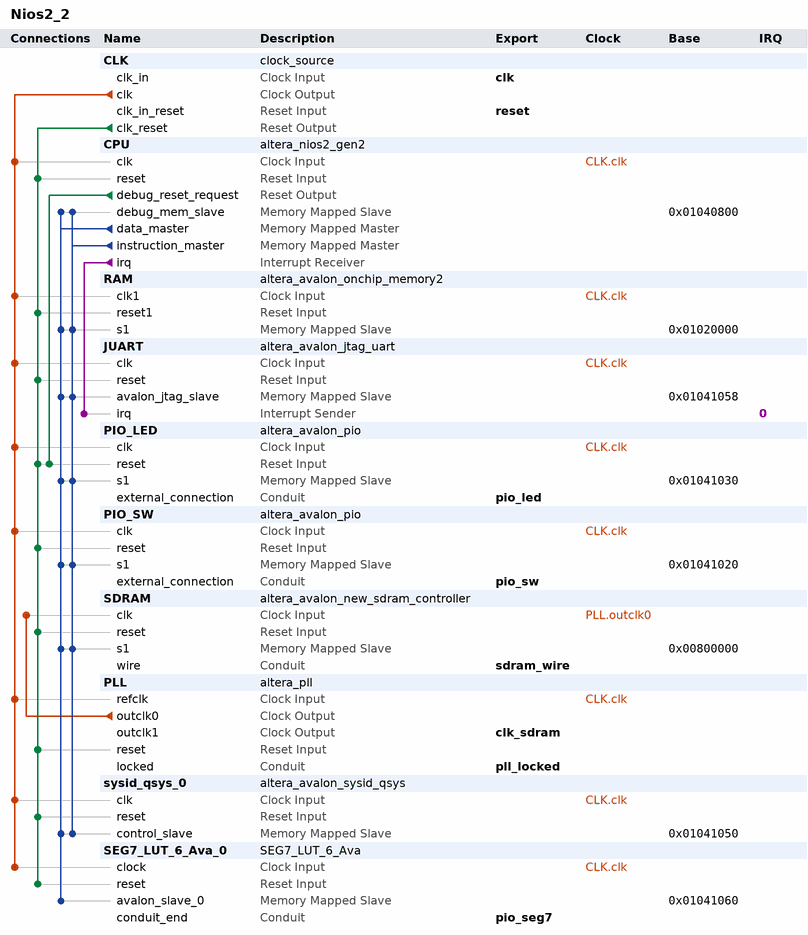
[diagram p0: system contents]
# Platform Designer (Qsys) system Nios2_2, Cyclone V 5CSXFC6D6F31C6
# Parameters at their usual value, and those the tool derives, are not listed.
package require -exact qsys 18.1
create_system Nios2_2
set_project_property DEVICE_FAMILY {Cyclone V}
set_project_property DEVICE 5CSXFC6D6F31C6

add_instance CLK clock_source 18.1
set_instance_parameter_value CLK clockFrequency 50000000

add_instance CPU altera_nios2_gen2 18.1
set_instance_parameter_value CPU dcache_size 2048
set_instance_parameter_value CPU exceptionSlave SDRAM.s1
set_instance_parameter_value CPU icache_size 4096
set_instance_parameter_value CPU impl Tiny
set_instance_parameter_value CPU resetSlave SDRAM.s1
set_instance_parameter_value CPU setting_activateTrace true

add_instance RAM altera_avalon_onchip_memory2 18.1
set_instance_parameter_value RAM dataWidth 32
set_instance_parameter_value RAM dualPort false
set_instance_parameter_value RAM initMemContent true
set_instance_parameter_value RAM initializationFileName onchip_mem.hex
set_instance_parameter_value RAM memorySize 122880

add_instance JUART altera_avalon_jtag_uart 18.1
set_instance_parameter_value JUART simInteractiveOptions NO_INTERACTIVE_WINDOWS

add_instance PIO_LED altera_avalon_pio 18.1
set_instance_parameter_value PIO_LED direction Output
set_instance_parameter_value PIO_LED width 8

add_instance PIO_SW altera_avalon_pio 18.1
set_instance_parameter_value PIO_SW direction Input
set_instance_parameter_value PIO_SW width 8

add_instance SDRAM altera_avalon_new_sdram_controller 18.1
set_instance_parameter_value SDRAM TAC 5.5
set_instance_parameter_value SDRAM TRCD 20.0
set_instance_parameter_value SDRAM TRP 20.0
set_instance_parameter_value SDRAM casLatency 3
set_instance_parameter_value SDRAM columnWidth 8
set_instance_parameter_value SDRAM dataWidth 16
set_instance_parameter_value SDRAM generateSimulationModel false
set_instance_parameter_value SDRAM model single_Micron_MT48LC4M32B2_7_chip
set_instance_parameter_value SDRAM numberOfBanks 4
set_instance_parameter_value SDRAM numberOfChipSelects 1
set_instance_parameter_value SDRAM powerUpDelay 100.0
set_instance_parameter_value SDRAM refreshPeriod 15.625
set_instance_parameter_value SDRAM rowWidth 12

add_instance PLL altera_pll 18.1
set_instance_parameter_value PLL gui_device_speed_grade 1
set_instance_parameter_value PLL gui_number_of_clocks 2
set_instance_parameter_value PLL gui_operation_mode normal
set_instance_parameter_value PLL gui_output_clock_frequency0 100.0
set_instance_parameter_value PLL gui_output_clock_frequency1 100.0
set_instance_parameter_value PLL gui_phase_shift1 -3800
set_instance_parameter_value PLL gui_pll_mode {Integer-N PLL}
set_instance_parameter_value PLL gui_reference_clock_frequency 50.0
set_instance_parameter_value PLL gui_use_locked true

add_instance sysid_qsys_0 altera_avalon_sysid_qsys 18.1
set_instance_parameter_value sysid_qsys_0 id 0

add_instance SEG7_LUT_6_Ava_0 SEG7_LUT_6_Ava 1.0

# connections
add_connection CLK.clk CPU.clk clock
add_connection CLK.clk JUART.clk clock
add_connection CLK.clk PIO_LED.clk clock
add_connection CLK.clk PIO_SW.clk clock
add_connection CLK.clk PLL.refclk clock
add_connection CLK.clk RAM.clk1 clock
add_connection CLK.clk SEG7_LUT_6_Ava_0.clock clock
add_connection CLK.clk sysid_qsys_0.clk clock
add_connection PLL.outclk0 SDRAM.clk clock
add_connection CLK.clk_reset CPU.reset reset
add_connection CLK.clk_reset JUART.reset reset
add_connection CLK.clk_reset PIO_LED.reset reset
add_connection CLK.clk_reset PIO_SW.reset reset
add_connection CLK.clk_reset PLL.reset reset
add_connection CLK.clk_reset RAM.reset1 reset
add_connection CLK.clk_reset SDRAM.reset reset
add_connection CLK.clk_reset SEG7_LUT_6_Ava_0.reset reset
add_connection CLK.clk_reset sysid_qsys_0.reset reset
add_connection CPU.debug_reset_request PIO_LED.reset reset
add_connection CPU.data_master CPU.debug_mem_slave avalon
set_connection_parameter_value CPU.data_master/CPU.debug_mem_slave baseAddress 0x01040800
add_connection CPU.data_master JUART.avalon_jtag_slave avalon
set_connection_parameter_value CPU.data_master/JUART.avalon_jtag_slave baseAddress 0x01041058
add_connection CPU.data_master PIO_LED.s1 avalon
set_connection_parameter_value CPU.data_master/PIO_LED.s1 baseAddress 0x01041030
add_connection CPU.data_master PIO_SW.s1 avalon
set_connection_parameter_value CPU.data_master/PIO_SW.s1 baseAddress 0x01041020
add_connection CPU.data_master RAM.s1 avalon
set_connection_parameter_value CPU.data_master/RAM.s1 baseAddress 0x01020000
add_connection CPU.data_master SDRAM.s1 avalon
set_connection_parameter_value CPU.data_master/SDRAM.s1 baseAddress 0x00800000
add_connection CPU.data_master SEG7_LUT_6_Ava_0.avalon_slave_0 avalon
set_connection_parameter_value CPU.data_master/SEG7_LUT_6_Ava_0.avalon_slave_0 baseAddress 0x01041060
add_connection CPU.data_master sysid_qsys_0.control_slave avalon
set_connection_parameter_value CPU.data_master/sysid_qsys_0.control_slave baseAddress 0x01041050
add_connection CPU.instruction_master CPU.debug_mem_slave avalon
set_connection_parameter_value CPU.instruction_master/CPU.debug_mem_slave baseAddress 0x01040800
add_connection CPU.instruction_master JUART.avalon_jtag_slave avalon
set_connection_parameter_value CPU.instruction_master/JUART.avalon_jtag_slave baseAddress 0x01041058
add_connection CPU.instruction_master PIO_LED.s1 avalon
set_connection_parameter_value CPU.instruction_master/PIO_LED.s1 baseAddress 0x01041030
add_connection CPU.instruction_master PIO_SW.s1 avalon
set_connection_parameter_value CPU.instruction_master/PIO_SW.s1 baseAddress 0x01041020
add_connection CPU.instruction_master RAM.s1 avalon
set_connection_parameter_value CPU.instruction_master/RAM.s1 baseAddress 0x01020000
add_connection CPU.instruction_master SDRAM.s1 avalon
set_connection_parameter_value CPU.instruction_master/SDRAM.s1 baseAddress 0x00800000
add_connection CPU.instruction_master sysid_qsys_0.control_slave avalon
set_connection_parameter_value CPU.instruction_master/sysid_qsys_0.control_slave baseAddress 0x01041050
add_connection CPU.irq JUART.irq interrupt
set_connection_parameter_value CPU.irq/JUART.irq irqNumber 0

# exported interfaces
add_interface clk clock sink
set_interface_property clk EXPORT_OF CLK.clk_in
add_interface clk_sdram clock source
set_interface_property clk_sdram EXPORT_OF PLL.outclk1
add_interface pio_led conduit end
set_interface_property pio_led EXPORT_OF PIO_LED.external_connection
add_interface pio_seg7 conduit end
set_interface_property pio_seg7 EXPORT_OF SEG7_LUT_6_Ava_0.conduit_end
add_interface pio_sw conduit end
set_interface_property pio_sw EXPORT_OF PIO_SW.external_connection
add_interface pll_locked conduit end
set_interface_property pll_locked EXPORT_OF PLL.locked
add_interface reset reset sink
set_interface_property reset EXPORT_OF CLK.clk_in_reset
add_interface sdram_wire conduit end
set_interface_property sdram_wire EXPORT_OF SDRAM.wire

set_interconnect_requirement {$system} qsys_mm.clockCrossingAdapter HANDSHAKE
set_interconnect_requirement {$system} qsys_mm.maxAdditionalLatency 1

save_system Nios2_2.qsys
